# EAGLE design con-isp-pin6 (EAGLE 5.11)
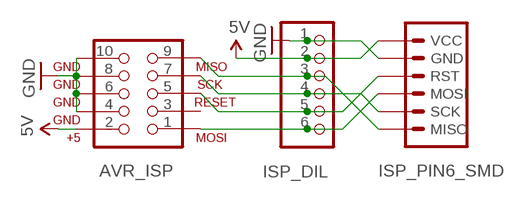
[diagram p0: schematic, sheet 1]

## Parts
AVR_ISP  AVR_SPI_PROG2LOCK  [2X5-SHROUDED_LOCK]
ISP_DIL  PINHD-1X6/90  [1X06/90]
ISP_PIN6_SMD  AVR_MINI_PROGSMD  [AVR_MINI_PROG]

## Nets
5V: AVR_ISP.2 ISP_DIL.2 ISP_PIN6_SMD.1(VCC)
GND: AVR_ISP.4 AVR_ISP.6 AVR_ISP.8 AVR_ISP.10 ISP_DIL.1 ISP_PIN6_SMD.2(GND)
N$1: AVR_ISP.1 ISP_DIL.6 ISP_PIN6_SMD.4(MOSI)
N$2: AVR_ISP.5 ISP_DIL.5 ISP_PIN6_SMD.3(RST)
N$3: AVR_ISP.7 ISP_DIL.4 ISP_PIN6_SMD.5(SCK)
N$4: AVR_ISP.9 ISP_DIL.3 ISP_PIN6_SMD.6(MISO)
Unconnected: AVR_ISP.3

## Library data of the parts
AVR_ISP = SparkFun:AVR_SPI_PROG2: AVR ICSP Header This is the standard AVR In Circuit Serial Programming header. Minimal, but includes pin one indicator. Works with standard Olimex programmers. Also look for the 6-pin reduced version. Spark Fun Electronics SKU: PRT-00778
ISP_DIL = pinhead:PINHD-1X6: PIN HEADER
ISP_PIN6_SMD = SparkFun:AVR_MINI_PROG

## Board
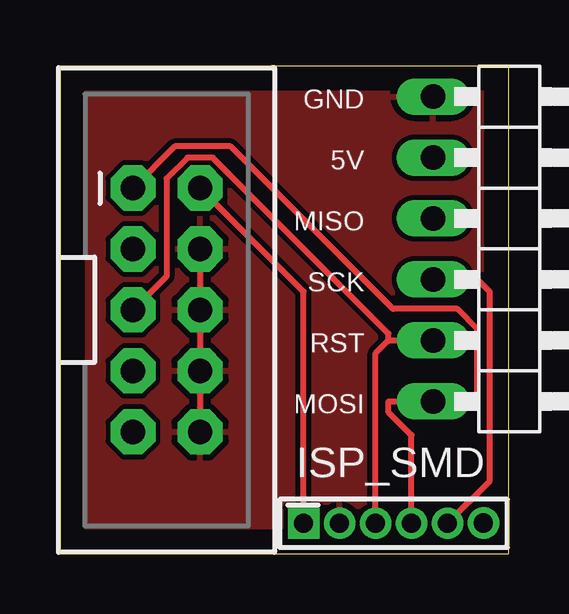
[diagram p1: board, top side]
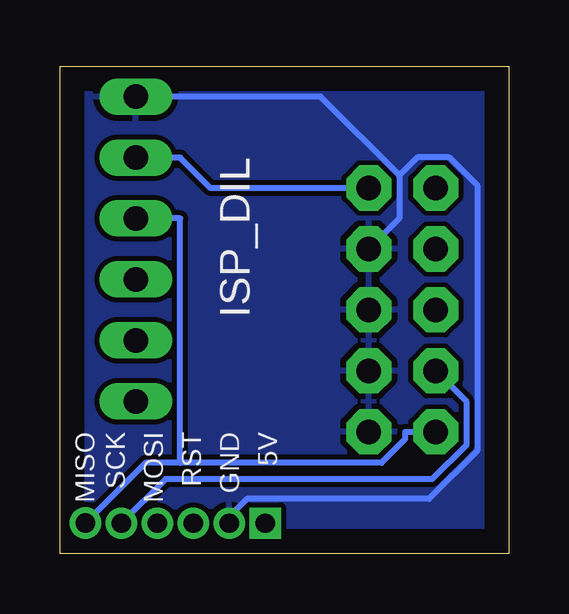
[diagram p2: board, bottom side, seen from below]

Size 18.72 x 20.31 mm. Coordinates in mm from the lower left corner, seen from the top.
Outline: 0,0 18.72,0 18.72,20.31 0,20.31 0,0
Copper layers (1*16): Top 0.035mm / dielectric 1.5mm / Bottom 0.035mm
Design rules "default": minimum track width 10mil, minimum drill 24mil, track to track 8mil, track to pad 8mil, pad to pad 8mil, via to via 8mil, smd to smd 8mil, copper to edge 40mil, drill to drill 8mil, minimum pad ring 10mil, minimum via ring 8mil, stop-mask expansion 4mil, vias tented up to drill 0mil, thermal gap 10mil

### Footprints (pad centres in the part's own frame; a part is rotated, then mirrored left to right if it is on the bottom)
2X5-SHROUDED_LOCK = drill 1.016 pad 1.88 octagon: 1 -1.397,5.08; 2 1.397,5.08; 3 -1.397,2.54; 4 1.397,2.54; 5 -1.397,0; 6 1.397,0; 7 -1.397,-2.54; 8 1.397,-2.54; 9 -1.397,-5.08; 10 1.397,-5.08
1X06/90 = drill 1.016 long: 1 -6.35,-3.81; 2 -3.81,-3.81; 3 -1.27,-3.81; 4 1.27,-3.81; 5 3.81,-3.81; 6 6.35,-3.81
AVR_MINI_PROG = drill 0.8 pad 1.27 square: 1 0,0 | drill 0.8 pad 1.27 round: 2 1.5,0; 3 3,0; 4 4.5,0; 5 6,0; 6 7.5,0.01

### Placement (x,y rotation side)
AVR_ISP  4.45,10.16 0 top
ISP_DIL  19.37,12.7 270 top
ISP_PIN6_SMD  10.16,1.27 0 top

### Tracks (layer width: path | path; a pad name or v marks a point on that pad's centre or on a via)
5V
  Top 0.254: AVR_ISP.2 10.16,10.92 ISP_PIN6_SMD.1
  Bottom 0.254: ISP_DIL.2 13.7,16.51 12.43,15.24 AVR_ISP.2
GND
  Top 0.254: AVR_ISP.10 AVR_ISP.8 AVR_ISP.6 AVR_ISP.4
  Bottom 0.254: 4.57,15.77 7.85,19.05 ISP_DIL.1 | AVR_ISP.4 4.57,13.98 4.57,15.77 | ISP_PIN6_SMD.2 11.66,1.55 10.92,2.28 3.33,2.28 1.3,4.32 1.3,15.33 2.48,16.51 3.82,16.51 4.57,15.77
  pour Bottom: 0,20.32 0,0 18.73,0 18.73,20.32
  pour Top: 0,20.32 18.73,20.32 18.73,0 0,0
N$1
  Top 0.254: ISP_PIN6_SMD.4 14.66,4.94 | 14.66,4.94 | 14.66,4.94 13.7,5.9 13.7,6.35 ISP_DIL.6 17.41,6.35 17.41,9.36 16.57,10.2 13.89,10.2 7.11,16.98 4.79,16.98 AVR_ISP.1
N$2
  Top 0.254: 13.7,8.89 13.7,9.18 6.37,16.51 5.32,16.51 4.45,15.64 4.45,11.56 AVR_ISP.5 | ISP_PIN6_SMD.3 13.16,8.35 13.7,8.89 | 13.7,8.89 ISP_DIL.5
N$3
  Top 0.254: ISP_DIL.4 17.41,11.43 17.92,10.92 17.92,3.03 ISP_PIN6_SMD.5
  Bottom 0.254: ISP_PIN6_SMD.5 14.32,3.11 3.2,3.11 1.76,4.55 1.76,6.33 AVR_ISP.7
N$4
  Bottom 0.254: 13.7,3.79 5.31,3.79 4.32,4.78 4.32,5.08 AVR_ISP.9 | ISP_PIN6_SMD.6 15.15,3.79 13.7,3.79 | 13.7,3.79 13.7,13.97 ISP_DIL.3

### Text on the board
tNames: GND | 5V | MISO | SCK | RST | MOSI | ISP_SMD
bNames: 5V | GND | RST | MOSI | SCK | MISO